# Altium schematic sheet SP3485.SchDoc
size A4
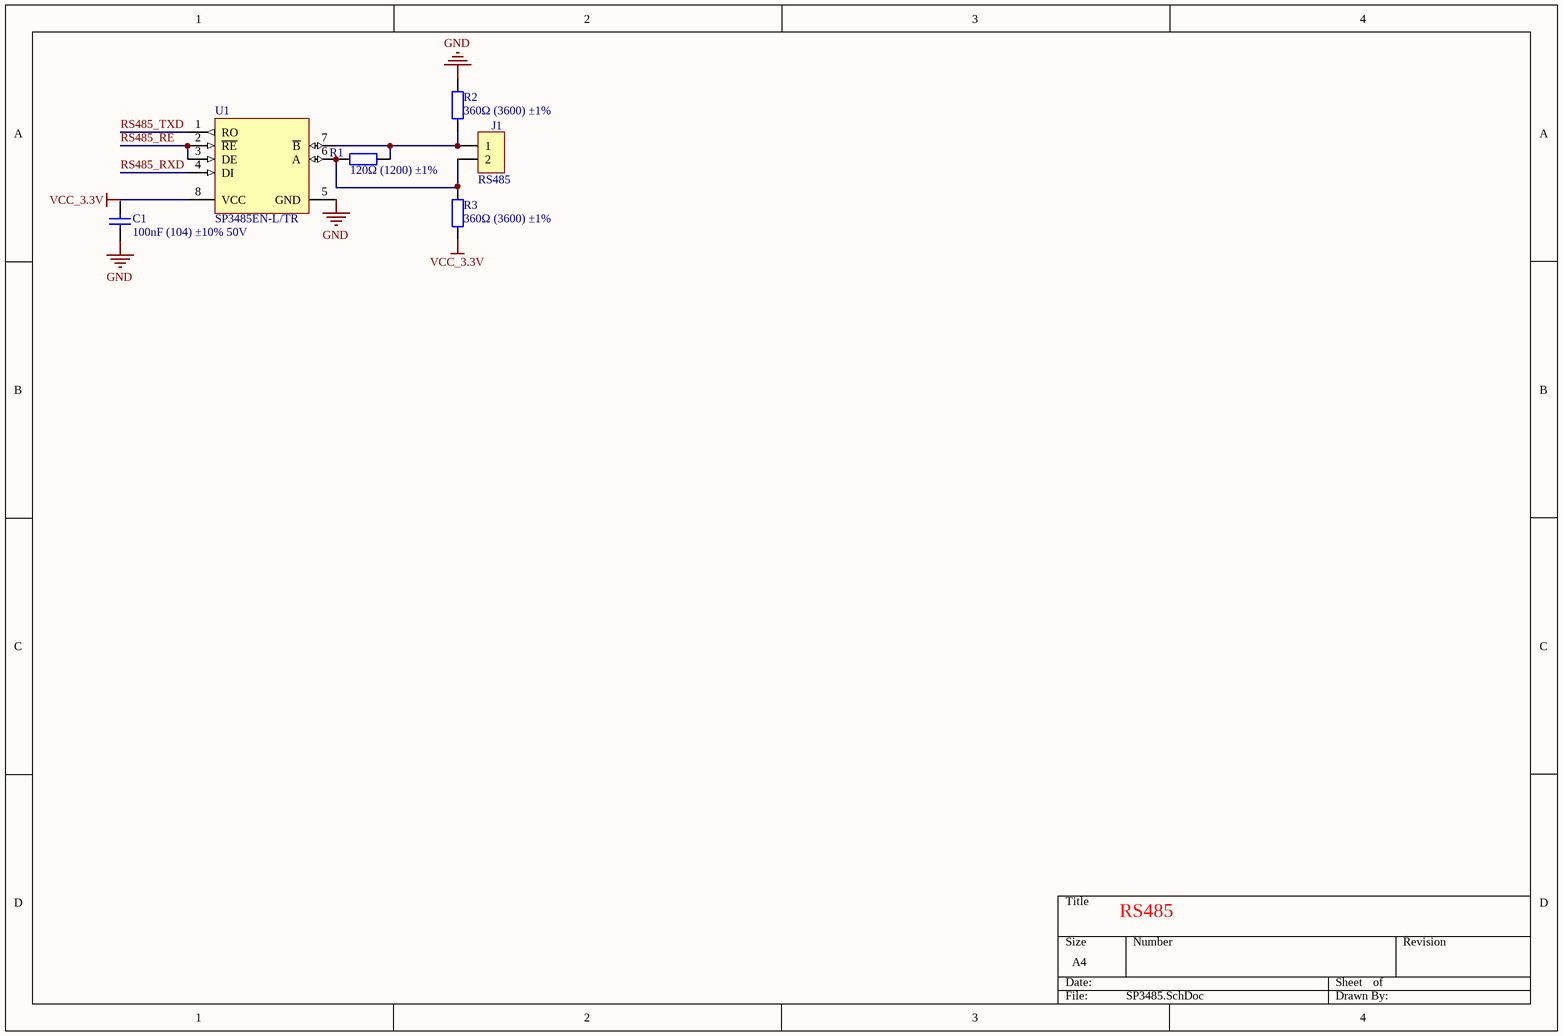
[diagram p0: SP3485.SchDoc]

## Parts
C1  100nF (104) ±10% 50V  [CAPC_0603_2]
J1  RS485
R1  120Ω (1200) ±1%  [RESC_0603_2]
R2  360Ω (3600) ±1%  [RESC_0603_2]
R3  360Ω (3600) ±1%  [RESC_0603_2]
U1  SP3485EN-L/TR  [SOIC_8]

## Nets
GND: C1.1 R2.2 U1.5(GND)
VCC_3.3V: R3.1 U1.8(VCC)
RS485_RE: U1.2(~{RE}) U1.3(DE)
RS485_RXD: U1.4(DI)
RS485_TXD: U1.1(RO)
NetJ1_1: J1.1 R1.2 R2.1 U1.7(~{B})
NetJ1_2: J1.2 R1.1 R3.2 U1.6(A)

Not connected (* = marked no-connect by the designer): C1 2

## Notes on the sheet
- RS485

## Library data of the parts
C1 = 0603 100nF (104) ±10% 50V: 贴片电容; ComponentLink1Description: 供应商链接; ComponentLink1URL: http://www.szlcsc.com/product/details_1986.html; Package: 0603; Supplier: LC; SuppliersPartNumber: C14663
J1 = Header 2: 2P接插件
R1 = 0603 120Ω (1200) ±1%: 贴片电阻; ComponentLink1Description: 供应商链接; ComponentLink1URL: http://www.szlcsc.com/product/details_21903.html; Package: 0603; Supplier: LC; SuppliersPartNumber: C22787
R2 R3 = 0603 360Ω (3600) ±1%: 贴片电阻; ComponentLink1Description: 供应商链接; ComponentLink1URL: http://www.szlcsc.com/product/details_21903.html; Package: 0603; Supplier: LC; SuppliersPartNumber: C25194
U1 = SP3485EN-L/TR_[C8963]: RS-485/RS-422; ComponentLink1Description: 供应商链接; ComponentLink1URL: http://www.szlcsc.com/product/details_9482.html; Package: SOIC-8; Supplier: LC; SuppliersPartNumber: C8963